# Altium schematic sheet adafruit flora neopixel.SchDoc
size 127 x 81 mm
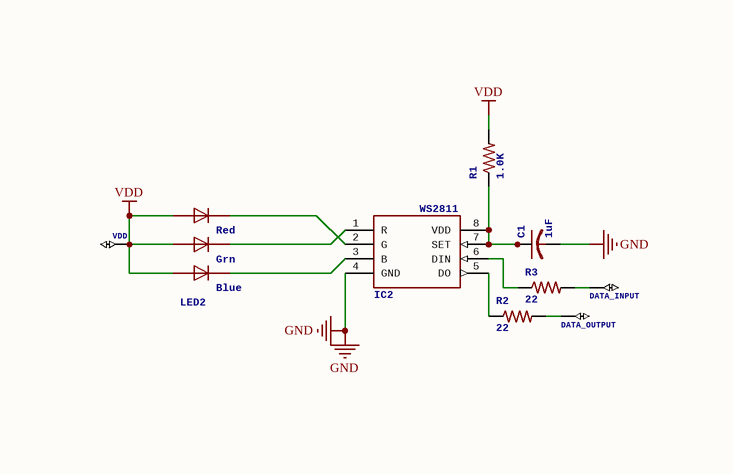
[diagram p0: adafruit flora neopixel.SchDoc]

## Parts
C1  1uF  [C0805K]
DATA_INPUT  SEWTAP0.5IN  [SEWINGTAP_0.5]  (value not drawn)
DATA_OUTPUT  SEWTAP0.5IN  [SEWINGTAP_0.5]  (value not drawn)
IC2  WS2811-SOP8  [SO08-SKINNYPADS]  (value not drawn)
LED2  RGBLED5050  [RGBLED5050]  (value not drawn)
R1  1.0K  [R0805]
R2  22  [R0805]
R3  22  [R0805]
VDD  SEWTAP0.5IN  [SEWINGTAP_0.5]  (value not drawn)

## Nets
GND: C1.2 IC2.4(GND)
VDD: LED2.1(GREEN_A) LED2.2(RED_A) LED2.3(BLUE_A) R1.2 VDD.TAP(SEW)
NetC1_1: C1.1 IC2.7(SET) IC2.8(VDD) R1.1
NetDATA_INPUT_TAP: DATA_INPUT.TAP(SEW) R3.2
NetDATA_OUTPUT_TAP: DATA_OUTPUT.TAP(SEW) R2.2
NetIC2_1: IC2.1(R) LED2.6(GREEN_C)
NetIC2_2: IC2.2(G) LED2.5(RED_C)
NetIC2_3: IC2.3(B) LED2.4(BLUE_C)
NetIC2_5: IC2.5(DO) R2.1
NetIC2_6: IC2.6(DIN) R3.1

## Library data of the parts
C1 = C-USC0805K: CAPACITOR, American symbol; GateName_1: G$1; SymbolName_1: C-US; DeviceName: C0805K; LibraryName: adafruit; DeviceSetName: C-US
DATA_INPUT DATA_OUTPUT VDD = SEWTAP0.5IN: GateName_1: G$1; SymbolName_1: SEWTAP; DeviceName: 0.5IN; LibraryName: adafruit; DeviceSetName: SEWTAP
IC2 = WS2811-SOP8: GateName_1: G$1; SymbolName_1: WS2811; DeviceName: -SOP8; LibraryName: adafruit; DeviceSetName: WS2811; WS2811: WS2811
LED2 = RGBLED5050: For 5050 RGB LEDs, the order of the LEDs may vary from one manufacturer to another!; GateName_1: G$1; SymbolName_1: RGBLED; DeviceName: 5050; LibraryName: adafruit; DeviceSetName: RGBLED; Red: Red; Grn: Grn; Blue: Blue
R1-R3 = R-US_R0805: RESISTOR, American symbol; GateName_1: G$1; SymbolName_1: R-US; DeviceSetName: R-US_; DeviceName: R0805; LibraryName: adafruit